# Altium project STM32F417 Demo Board.PrjPcb (part 4 of 4)

## Sheet Mechanical.SchDoc
size A3; SheetNumber: 14; SheetTotal: 15
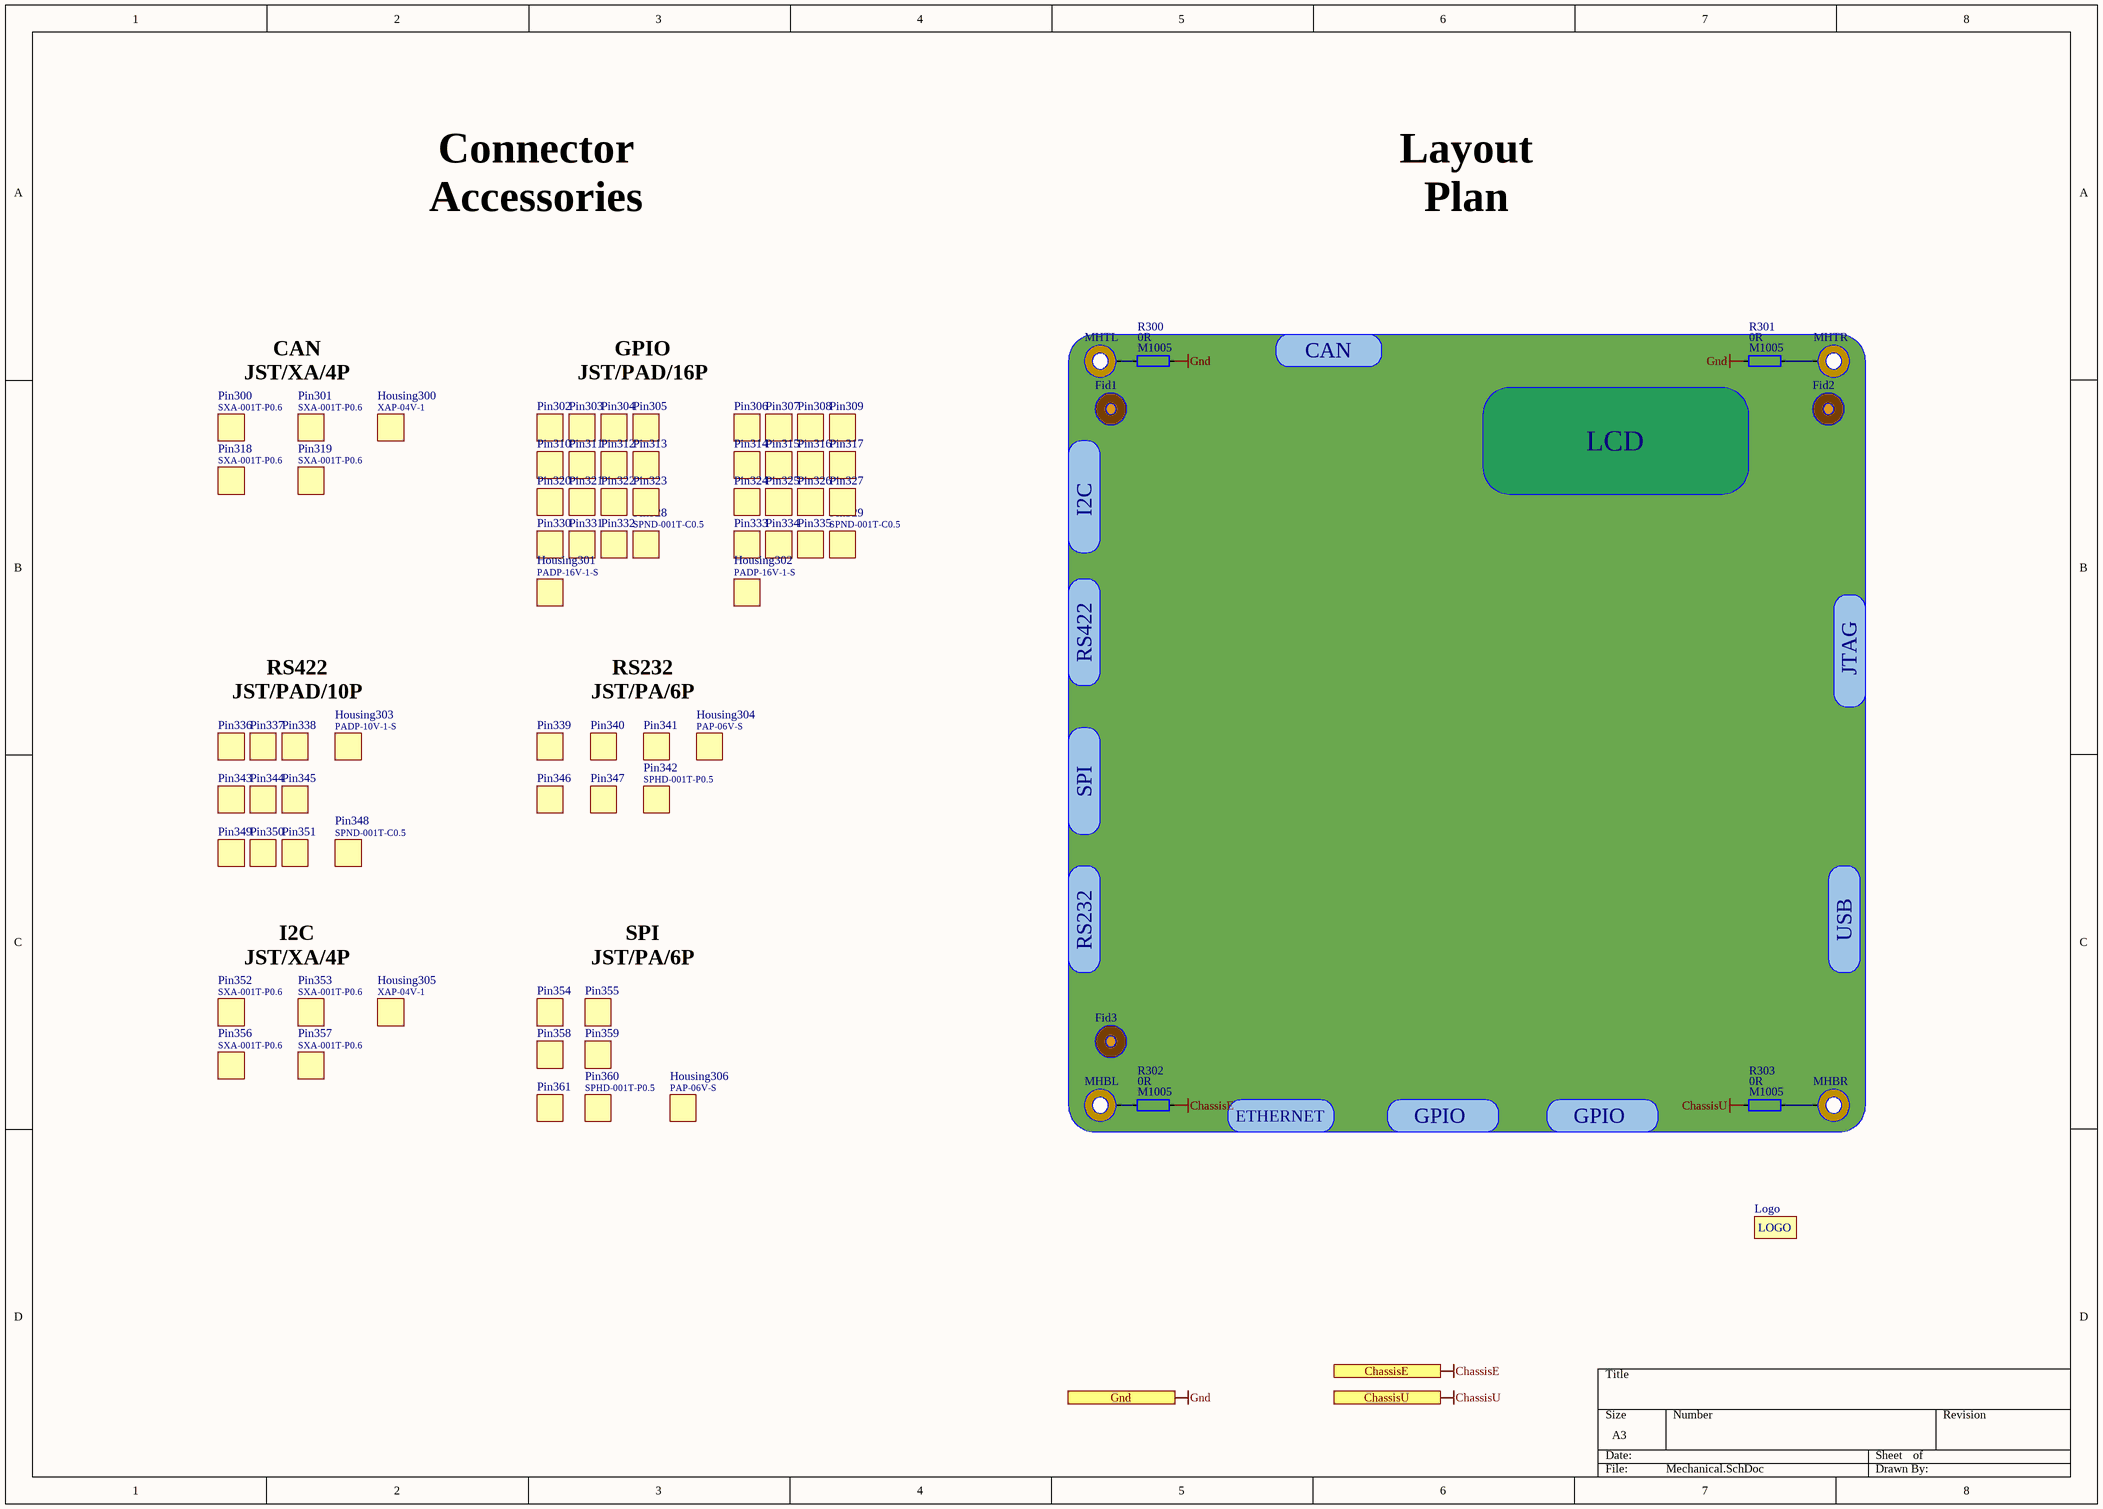
[diagram p13: Mechanical.SchDoc]

### Parts
Fid1  Fiducial  [Fiducial - 2mm, 5mm]  (value not drawn)  (no BOM)
Fid2  Fiducial  [Fiducial - 2mm, 5mm]  (value not drawn)  (no BOM)
Fid3  Fiducial  [Fiducial - 2mm, 5mm]  (value not drawn)  (no BOM)
Housing300  Manufacturer Part Number: XAP-04V-1  [Housing, PAP-06V-S]  (hidden comment: Housing)
Housing301  Manufacturer Part Number: PADP-16V-1-S  [Housing, PADP-16V-1-S]  (hidden comment: Housing)
Housing302  Manufacturer Part Number: PADP-16V-1-S  [Housing, PADP-16V-1-S]  (hidden comment: Housing)
Housing303  Manufacturer Part Number: PADP-10V-1-S  [Housing, PADP-10V-1-S]  (hidden comment: Housing)
Housing304  Manufacturer Part Number: PAP-06V-S  [Housing, PAP-06V-S]  (hidden comment: Housing)
Housing305  Manufacturer Part Number: XAP-04V-1  [Housing, PAP-06V-S]  (hidden comment: Housing)
Housing306  Manufacturer Part Number: PAP-06V-S  [Housing, PAP-06V-S]  (hidden comment: Housing)
Logo  Logo  [Logo 1]  (value not drawn)  (no BOM)
MHBL  Mounting Hole  [Mounting Hole - Hole-3.2mm, Pad-5mm]  (value not drawn)  (no BOM)
MHBR  Mounting Hole  [Mounting Hole - Hole-3.2mm, Pad-5mm]  (value not drawn)  (no BOM)
MHTL  Mounting Hole  [Mounting Hole - Hole-3.2mm, Pad-5mm]  (value not drawn)  (no BOM)
MHTR  Mounting Hole  [Mounting Hole - Hole-3.2mm, Pad-5mm]  (value not drawn)  (no BOM)
Pin300  Manufacturer Part Number: SXA-001T-P0.6  [Pin, SPHD-001T-P0.5]  (hidden comment: Pin)
Pin301  Manufacturer Part Number: SXA-001T-P0.6  [Pin, SPHD-001T-P0.5]  (hidden comment: Pin)
Pin302  Pin  [Pin, SPND-001T-C0.5]  (value not drawn)
Pin303  Pin  [Pin, SPND-001T-C0.5]  (value not drawn)
Pin304  Pin  [Pin, SPND-001T-C0.5]  (value not drawn)
Pin305  Pin  [Pin, SPND-001T-C0.5]  (value not drawn)
Pin306  Pin  [Pin, SPND-001T-C0.5]  (value not drawn)
Pin307  Pin  [Pin, SPND-001T-C0.5]  (value not drawn)
Pin308  Pin  [Pin, SPND-001T-C0.5]  (value not drawn)
Pin309  Pin  [Pin, SPND-001T-C0.5]  (value not drawn)
Pin310  Pin  [Pin, SPND-001T-C0.5]  (value not drawn)
Pin311  Pin  [Pin, SPND-001T-C0.5]  (value not drawn)
Pin312  Pin  [Pin, SPND-001T-C0.5]  (value not drawn)
Pin313  Pin  [Pin, SPND-001T-C0.5]  (value not drawn)
Pin314  Pin  [Pin, SPND-001T-C0.5]  (value not drawn)
Pin315  Pin  [Pin, SPND-001T-C0.5]  (value not drawn)
Pin316  Pin  [Pin, SPND-001T-C0.5]  (value not drawn)
Pin317  Pin  [Pin, SPND-001T-C0.5]  (value not drawn)
Pin318  Manufacturer Part Number: SXA-001T-P0.6  [Pin, SPHD-001T-P0.5]  (hidden comment: Pin)
Pin319  Manufacturer Part Number: SXA-001T-P0.6  [Pin, SPHD-001T-P0.5]  (hidden comment: Pin)
Pin320  Pin  [Pin, SPND-001T-C0.5]  (value not drawn)
Pin321  Pin  [Pin, SPND-001T-C0.5]  (value not drawn)
Pin322  Pin  [Pin, SPND-001T-C0.5]  (value not drawn)
Pin323  Pin  [Pin, SPND-001T-C0.5]  (value not drawn)
Pin324  Pin  [Pin, SPND-001T-C0.5]  (value not drawn)
Pin325  Pin  [Pin, SPND-001T-C0.5]  (value not drawn)
Pin326  Pin  [Pin, SPND-001T-C0.5]  (value not drawn)
Pin327  Pin  [Pin, SPND-001T-C0.5]  (value not drawn)
Pin328  Manufacturer Part Number: SPND-001T-C0.5  [Pin, SPND-001T-C0.5]  (hidden comment: Pin)
Pin329  Manufacturer Part Number: SPND-001T-C0.5  [Pin, SPND-001T-C0.5]  (hidden comment: Pin)
Pin330  Pin  [Pin, SPND-001T-C0.5]  (value not drawn)
Pin331  Pin  [Pin, SPND-001T-C0.5]  (value not drawn)
Pin332  Pin  [Pin, SPND-001T-C0.5]  (value not drawn)
Pin333  Pin  [Pin, SPND-001T-C0.5]  (value not drawn)
Pin334  Pin  [Pin, SPND-001T-C0.5]  (value not drawn)
Pin335  Pin  [Pin, SPND-001T-C0.5]  (value not drawn)
Pin336  Pin  [Pin, SPND-001T-C0.5]  (value not drawn)
Pin337  Pin  [Pin, SPND-001T-C0.5]  (value not drawn)
Pin338  Pin  [Pin, SPND-001T-C0.5]  (value not drawn)
Pin339  Pin  [Pin, SPHD-001T-P0.5]  (value not drawn)
Pin340  Pin  [Pin, SPHD-001T-P0.5]  (value not drawn)
Pin341  Pin  [Pin, SPHD-001T-P0.5]  (value not drawn)
Pin342  Manufacturer Part Number: SPHD-001T-P0.5  [Pin, SPHD-001T-P0.5]  (hidden comment: Pin)
Pin343  Pin  [Pin, SPND-001T-C0.5]  (value not drawn)
Pin344  Pin  [Pin, SPND-001T-C0.5]  (value not drawn)
Pin345  Pin  [Pin, SPND-001T-C0.5]  (value not drawn)
Pin346  Pin  [Pin, SPHD-001T-P0.5]  (value not drawn)
Pin347  Pin  [Pin, SPHD-001T-P0.5]  (value not drawn)
Pin348  Manufacturer Part Number: SPND-001T-C0.5  [Pin, SPND-001T-C0.5]  (hidden comment: Pin)
Pin349  Pin  [Pin, SPND-001T-C0.5]  (value not drawn)
Pin350  Pin  [Pin, SPND-001T-C0.5]  (value not drawn)
Pin351  Pin  [Pin, SPND-001T-C0.5]  (value not drawn)
Pin352  Manufacturer Part Number: SXA-001T-P0.6  [Pin, SPHD-001T-P0.5]  (hidden comment: Pin)
Pin353  Manufacturer Part Number: SXA-001T-P0.6  [Pin, SPHD-001T-P0.5]  (hidden comment: Pin)
Pin354  Pin  [Pin, SPHD-001T-P0.5]  (value not drawn)
Pin355  Pin  [Pin, SPHD-001T-P0.5]  (value not drawn)
Pin356  Manufacturer Part Number: SXA-001T-P0.6  [Pin, SPHD-001T-P0.5]  (hidden comment: Pin)
Pin357  Manufacturer Part Number: SXA-001T-P0.6  [Pin, SPHD-001T-P0.5]  (hidden comment: Pin)
Pin358  Pin  [Pin, SPHD-001T-P0.5]  (value not drawn)
Pin359  Pin  [Pin, SPHD-001T-P0.5]  (value not drawn)
Pin360  Manufacturer Part Number: SPHD-001T-P0.5  [Pin, SPHD-001T-P0.5]  (hidden comment: Pin)
Pin361  Pin  [Pin, SPHD-001T-P0.5]  (value not drawn)
R300  value 0R  Package: M1005  [Resistor_Smd_M1005_I0402]  (hidden comment: Resistor)
R301  value 0R  Package: M1005  [Resistor_Smd_M1005_I0402]  (hidden comment: Resistor)
R302  value 0R  Package: M1005  [Resistor_Smd_M1005_I0402]  (hidden comment: Resistor)
R303  value 0R  Package: M1005  [Resistor_Smd_M1005_I0402]  (hidden comment: Resistor)

### Blocks framed on the sheet
LCD: Fid1-Fid3 MHBL MHBR MHTL MHTR R300-R303

### Ports
ChassisE (out), ChassisU (out), Gnd (in)

### Nets
ChassisE: R302.2 ; port ChassisE
ChassisU: R303.1 ; port ChassisU
Gnd: R300.2 R301.1 ; port Gnd
NetMHBL_Hole: MHBL.Hole R302.1
NetMHBR_Hole: MHBR.Hole R303.2
NetMHTL_Hole: MHTL.Hole R300.1
NetMHTR_Hole: MHTR.Hole R301.2

### Notes on the sheet
- Connector
  Accessories
- Layout
  Plan
- CAN
  JST/XA/4P
- GPIO
  JST/PAD/16P
- CAN
- I2C
- RS422
- JTAG
- RS422
  JST/PAD/10P
- RS232
  JST/PA/6P
- SPI
- RS232
- USB
- I2C
  JST/XA/4P
- SPI
  JST/PA/6P
- ETHERNET
- GPIO
- (in symbol Logo) LOGO

### Library data of the parts
Fid1-Fid3 = Fiducial: Mechanical, Fiducial, PCB, 2mm/5mm; Component Type: Fiducial; Component Category: Mechanical
Housing300 Housing305 = Housing: Housing, JST, 4P, XA; Component Category: Connector; ComponentLink1Description: Datasheet; ComponentLink1URL: E:\Altium\Datasheets\Connector - JST\XA Family.pdf; ComponentLink2Description: Supplier Link; ComponentLink2URL: https://www.digikey.com/en/products/detail/jst-sales-america-inc/XAP-04V-1/959010; Supplier: Digikey; Supplier Part Number: 455-2150-ND; Manufacturer: JST; Operating Temperature, Min: -25℃; Operating Temperature, Max: +85℃; Quantity, Min: 1; Quantity, Max: 2500; Price, Min: 0.16; Supplier Currency: $; Price, Max: 0.05958; Supplier Link: https://www.digikey.com/en/products/detail/jst-sales-america-inc/XAP-04V-1/959010; Component Type: Housing; Package: Housing
Housing301 Housing302 = Housing: Housing, JST, 16P, PAD; Component Category: Connector; ComponentLink1Description: Datasheet; ComponentLink1URL: E:\Altium\Datasheets\Connector - JST\PAD Family.pdf; ComponentLink2Description: Supplier Link; ComponentLink2URL: https://www.digikey.com/en/products/detail/jst-sales-america-inc/PADP-16V-1-S/1300224; Supplier: Digikey; Supplier Part Number: 455-2143-ND; Manufacturer: JST; Operating Temperature, Min: -25℃; Operating Temperature, Max: +85℃; Quantity, Min: 1; Quantity, Max: 2500; Price, Min: 0.35; Supplier Currency: $; Price, Max: 0.152; Supplier Link: https://www.digikey.com/en/products/detail/jst-sales-america-inc/PADP-16V-1-S/1300224?s=N4IgTCBcDaIAoEEAicC0BGAbANQyAugL5A; Component Type: PCB; Package: Housing
Housing303 = Housing: Housing, JST, 10P, PAD; Component Category: Connector; ComponentLink1Description: Datasheet; ComponentLink1URL: E:\Altium\Datasheets\Connector - JST\PAD Family.pdf; ComponentLink2Description: Supplier Link; ComponentLink2URL: https://www.digikey.com/en/products/detail/jst-sales-america-inc/PADP-10V-1-S/1300221; Supplier: Digikey; Supplier Part Number: 455-2140-ND; Manufacturer: JST; Operating Temperature, Min: -25℃; Operating Temperature, Max: +85℃; Quantity, Min: 1; Quantity, Max: 2500; Price, Min: 0.33; Supplier Currency: $; Price, Max: 0.14264; Supplier Link: https://www.digikey.com/en/products/detail/jst-sales-america-inc/PADP-10V-1-S/1300221; Component Type: PCB; Package: Housing
Housing304 = Housing: Housing, JST, PAP-06V-S; Component Category: Connector; ComponentLink1Description: Datasheet; ComponentLink1URL: E:\Altium\Datasheets\Connector - JST\PA Family.pdf; ComponentLink2Description: Supplier Link; ComponentLink2URL: https://www.digikey.com/en/products/detail/jst-sales-america-inc/PAP-06V-S/759978; Supplier: Digikey; Supplier Part Number: 455-1490-ND; Manufacturer: JST; Operating Temperature, Min: -25℃; Operating Temperature, Max: +85℃; Quantity, Min: 1; Quantity, Max: 2500; Price, Min: 0.19; Supplier Currency: $; Price, Max: 0.07808; Supplier Link: https://www.digikey.com/en/products/detail/jst-sales-america-inc/PAP-06V-S/759978; Component Type: PCB; Package: Housing
Housing306 = Housing: IC, Interface, FTDI, QFN-16; Manufacturer: JST; Component Category: Connector; ComponentLink1Description: Datasheet; ComponentLink1URL: E:\Altium\Datasheets\Connector - JST\PA Family.pdf; ComponentLink2Description: Supplier Link; ComponentLink2URL: https://www.digikey.com/en/products/detail/jst-sales-america-inc/PAP-06V-S/759978; Supplier: Digikey; Supplier Part Number: 455-1490-ND; Operating Temperature, Min: -25℃; Operating Temperature, Max: +85℃; Quantity, Min: 1; Quantity, Max: 2500; Price, Min: 0.19; Supplier Currency: $; Price, Max: 0.07808; Supplier Link: https://www.digikey.com/en/products/detail/jst-sales-america-inc/PAP-06V-S/759978; Component Type: PCB; Package: Housing
Logo = Logo: Mechanical, Logo; Component Type: Logo; Component Category: Mechanical
MHBL MHBR MHTL MHTR = Mounting Hole: Mechanical, Mounting Hole; Component Type: Mounting Hole; Component Category: Mechanical
Pin300 Pin301 Pin318 Pin319 Pin352 Pin353 Pin356 Pin357 = Pin: Pin, JST, SXA-001T-P0.6; Component Category: Connector; ComponentLink1Description: Datasheet; ComponentLink1URL: E:\Altium\Datasheets\Connector - JST\XA Family.pdf; ComponentLink2Description: Supplier Link; ComponentLink2URL: https://www.digikey.com/en/products/detail/jst-sales-america-inc/SXA-001T-P0-6/923775; Supplier: Digikey; Supplier Part Number: 455-1904-1-ND; Manufacturer: JST; Operating Temperature, Min: ---℃; Operating Temperature, Max: ---℃; Quantity, Min: 1; Quantity, Max: 56000; Price, Min: 0.1; Supplier Currency: $; Price, Max: 0.01303; Supplier Link: https://www.digikey.com/en/products/detail/jst-sales-america-inc/SXA-001T-P0-6/923775; Component Type: Pin; Package: Housing
Pin302-Pin317 Pin320-Pin338 Pin343-Pin345 Pin348-Pin351 = Pin: Pin, JST, SPND-001T-C0.5; Component Category: Connector; ComponentLink1Description: Datasheet; ComponentLink1URL: E:\Altium\Datasheets\Connector - JST\PAD Family.pdf; ComponentLink2Description: Supplier Link; ComponentLink2URL: https://www.digikey.com/en/products/detail/jst-sales-america-inc/SPND-001T-C0-5/1788519; Supplier: Digikey; Supplier Part Number: 455-2303-1-ND; Manufacturer: JST; Operating Temperature, Min: ---℃; Operating Temperature, Max: ---℃; Quantity, Min: 1; Quantity, Max: 56000; Price, Min: 0.1; Supplier Currency: $; Price, Max: 0.01409; Supplier Link: https://www.digikey.com/en/products/detail/jst-sales-america-inc/SPND-001T-C0-5/1788519; Component Type: PCB; Package: Housing
  Pin302-Pin317 Pin320-Pin327 Pin330-Pin338 Pin343-Pin345 Pin349-Pin351: Manufacturer Part Number: SPND-001T-C0.5
Pin339-Pin342 Pin346 Pin347 = Pin: Pin, JST, SPHD-001T-P0.5; Component Category: Connector; ComponentLink1Description: Datasheet; ComponentLink1URL: E:\Altium\Datasheets\Connector - JST\PA Family.pdf; ComponentLink2Description: Supplier Link; ComponentLink2URL: https://www.digikey.com/en/products/detail/jst-sales-america-inc/SPHD-001T-P0-5/608766; Supplier: Digikey; Supplier Part Number: 455-1325-1-ND; Manufacturer: JST; Operating Temperature, Min: *℃; Operating Temperature, Max: *℃; Quantity, Min: 1; Quantity, Max: 2500; Price, Min: 0.1; Supplier Currency: $; Price, Max: 0.01478; Supplier Link: https://www.digikey.com/en/products/detail/jst-sales-america-inc/SPHD-001T-P0-5/608766; Component Type: PCB; Package: Housing
  Pin339-Pin341 Pin346 Pin347: Manufacturer Part Number: SPHD-001T-P0.5
Pin354 Pin355 Pin358 Pin359 Pin361 = Pin: IC, Interface, FTDI, QFN-16; Manufacturer: JST; Manufacturer Part Number: SPHD-001T-P0.5; Component Category: Connector; ComponentLink1Description: Datasheet; ComponentLink1URL: E:\Altium\Datasheets\Connector - JST\PA Family.pdf; ComponentLink2Description: Supplier Link; ComponentLink2URL: https://www.digikey.com/en/products/detail/jst-sales-america-inc/SPHD-001T-P0-5/608766; Supplier: Digikey; Supplier Part Number: 455-1325-1-ND; Operating Temperature, Min: *℃; Operating Temperature, Max: *℃; Quantity, Min: 1; Quantity, Max: 2500; Price, Min: 0.1; Supplier Currency: $; Price, Max: 0.01478; Supplier Link: https://www.digikey.com/en/products/detail/jst-sales-america-inc/SPHD-001T-P0-5/608766; Component Type: PCB; Package: Housing
Pin360 = Pin: IC, Interface, FTDI, QFN-16; Manufacturer: JST; Component Category: Connector; ComponentLink1Description: Datasheet; ComponentLink1URL: E:\Altium\Datasheets\Connector - JST\PA Family.pdf; ComponentLink2Description: Supplier Link; ComponentLink2URL: https://www.digikey.com/en/products/detail/jst-sales-america-inc/SPHD-001T-P0-5/608766; Supplier: Digikey; Supplier Part Number: 455-1325-1-ND; Operating Temperature, Min: *℃; Operating Temperature, Max: *℃; Quantity, Min: 1; Quantity, Max: 2500; Price, Min: 0.1; Supplier Currency: $; Price, Max: 0.01478; Supplier Link: https://www.digikey.com/en/products/detail/jst-sales-america-inc/SPHD-001T-P0-5/608766; Component Type: PCB; Package: Housing
R300-R303 = Resistor: Res, 0R, M1005; Manufacturer: Yageo; Manufacturer Part Number: RC0402FR-070RL; Component Category: Resistor; Component Type: Fixed Value; Tolerance: *; Supplier Link: https://www.digikey.com/en/products/detail/yageo/RC0402FR-070RL/2827570; Supplier Currency: $; Price, Max: 0.00109; Price, Min: 0.1; Quantity, Max: 50000; Quantity, Min: 1; Operating Temperature, Max: -55℃; Operating Temperature, Min: +155℃; Supplier Part Number: 311-0.0LRCT-ND; Supplier: Digikey; ComponentLink1Description: Datasheet; ComponentLink1URL: E:\Altium\Datasheets\Resistor\Yageo - RC_L Series.pdf; ComponentLink2Description: Supplier Link; ComponentLink2URL: https://www.digikey.com/en/products/detail/yageo/RC0402FR-070RL/2827570

## Sheet I2C-SPI.SchDoc
size A4; SheetNumber: 15; SheetTotal: 15
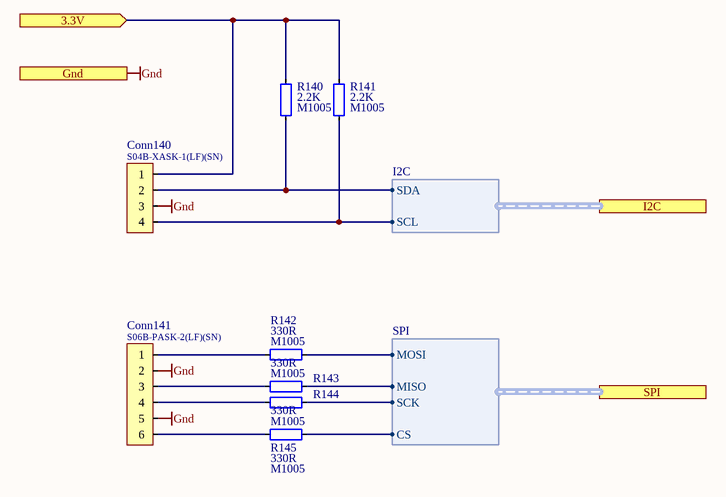
[diagram p14: I2C-SPI.SchDoc]

### Parts
Conn140  Manufacturer Part Number: S04B-XASK-1(LF)(SN)  [Connector, S04B-XASK-1]  (hidden comment: Connector - 4P)
Conn141  Manufacturer Part Number: S06B-PASK-2(LF)(SN)  [Connector, S06B-PASK-2]  (hidden comment: Connector - 6P)
R140  value 2.2K  Package: M1005  [Resistor_Smd_M1005_I0402]  (hidden comment: Resistor)
R141  value 2.2K  Package: M1005  [Resistor_Smd_M1005_I0402]  (hidden comment: Resistor)
R142  value 330R  Package: M1005  [Resistor_Smd_M1005_I0402]  (hidden comment: Resistor)
R143  value 330R  Package: M1005  [Resistor_Smd_M1005_I0402]  (hidden comment: Resistor)
R144  value 330R  Package: M1005  [Resistor_Smd_M1005_I0402]  (hidden comment: Resistor)
R145  value 330R  Package: M1005  [Resistor_Smd_M1005_I0402]  (hidden comment: Resistor)

### Ports
3.3V (in), Gnd (in), I2C (harness I2C), SPI (harness SPI)

### Harnesses
SPI: MOSI, MISO, SCK, CS
I2C: SDA, SCL

### Nets
3.3V: Conn140.1 R140.1 R141.1 ; port 3.3V
Gnd: Conn140.3 Conn141.2 Conn141.5 ; port Gnd
I2C1_Scl: Conn140.4 R141.2 ; port I2C.SCL
I2C1_Sda: Conn140.2 R140.2 ; port I2C.SDA
MISO: R143.2 ; port SPI.MISO
MOSI: R142.2 ; port SPI.MOSI
PA4: R145.2 ; port SPI.CS
PA5: R144.2 ; port SPI.SCK
NetConn141_1: Conn141.1 R142.1
NetConn141_3: Conn141.3 R143.1
NetConn141_4: Conn141.4 R144.1
NetConn141_6: Conn141.6 R145.1

### Library data of the parts
Conn140 = Connector - 4P: Conn, JST, 4P, TH, XA, Side Entry; ComponentLink1Description: Datasheet; ComponentLink1URL: E:\Altium\Datasheets\Connector - JST\XA Family.pdf; ComponentLink2Description: Supplier Link; ComponentLink2URL: https://www.digikey.com/en/products/detail/jst-sales-america-inc/S04B-XASK-1-LF-SN/7230506; Supplier: Digikey; Supplier Part Number: 455-4090-ND; Manufacturer: JST; Operating Temperature, Min: -25℃; Operating Temperature, Max: +85℃; Quantity, Min: 1; Quantity, Max: 10000; Price, Min: 0.53; Supplier Currency: $; Price, Max: 0.22547; Supplier Link: https://www.digikey.com/en/products/detail/jst-sales-america-inc/S04B-XASK-1-LF-SN/7230506; Component Type: PCB; Component Category: Connector; Package: SMD, TH, Side Entry
Conn141 = Connector - 6P: Conn, JST, 6P, TH, PA, Side Entry; ComponentLink1Description: Datasheet; ComponentLink1URL: E:\Altium\Datasheets\Connector - JST\PA Family.pdf; ComponentLink2Description: Supplier Link; ComponentLink2URL: https://www.digikey.com/en/products/detail/jst-sales-america-inc/S06B-PASK-2-LF-SN/926757; Supplier: Digikey; Supplier Part Number: 455-1851-ND; Manufacturer: JST; Operating Temperature, Min: -25℃; Operating Temperature, Max: +85℃; Quantity, Min: 1; Quantity, Max: 10000; Price, Min: 0.51; Supplier Currency: $; Price, Max: 0.21423; Supplier Link: https://www.digikey.com/en/products/detail/jst-sales-america-inc/S06B-PASK-2-LF-SN/926757; Component Type: PCB; Component Category: Connector; Package: TH, RA, Side Entry
R140 R141 = Resistor: Res, 2.2K, 1%, M1005; Manufacturer: Yageo; Manufacturer Part Number: RC0402FR-072K2L; Component Category: Resistor; Component Type: Fixed Value; Tolerance: 1%; Supplier Link: https://www.digikey.com/en/products/detail/yageo/RC0402FR-072K2L/726553; Supplier Currency: $; Price, Max: 0.00129; Price, Min: 0.1; Quantity, Max: 100000; Quantity, Min: 1; Operating Temperature, Max: -55℃; Operating Temperature, Min: +155℃; Supplier Part Number: 311-2.20KLRCT-ND; Supplier: Digikey; ComponentLink1Description: Datasheet; ComponentLink1URL: E:\Altium\Datasheets\Resistor\Yageo - RC_L Series.pdf; ComponentLink2Description: Supplier Link; ComponentLink2URL: https://www.digikey.com/en/products/detail/yageo/RC0402FR-072K2L/726553
R142-R145 = Resistor: Res, 330R, 1%, M1005; Manufacturer: Yageo; Manufacturer Part Number: RC0402FR-07330RL; Component Category: Resistor; Component Type: Fixed Value; Tolerance: 1%; Supplier Link: https://www.digikey.com/en/products/detail/yageo/RC0402FR-07330RL/726594; Supplier Currency: $; Price, Max: 0.00129; Price, Min: 0.1; Quantity, Max: 100000; Quantity, Min: 1; Operating Temperature, Max: -55℃; Operating Temperature, Min: +155℃; Supplier Part Number: 311-330LRCT-ND; Supplier: Digikey; ComponentLink1Description: Datasheet; ComponentLink1URL: E:\Altium\Datasheets\Resistor\Yageo - RC_L Series.pdf; ComponentLink2Description: Supplier Link; ComponentLink2URL: https://www.digikey.com/en/products/detail/yageo/RC0402FR-07330RL/726594

## Nets that join several sheets
3.3V: Microcontroller (Conn700.1 Conn700.2 R706.1 R716.1), LCD (R670.1), FTDI (R682.1), Power (R114.2 R115.2), GPIO (R201.1 R202.2 R204.1 R205.2), GPIO/Bt1 (Sw40_Bt1.A), GPIO/Bt2 (Sw40_Bt2.A), GPIO/Bt3 (Sw40_Bt3.A), GPIO/Sw1 (Sw60_Sw1.A), GPIO/Sw2 (Sw60_Sw2.A), GPIO/Sw3 (Sw60_Sw3.A), GPIO/LdR (R80_LdR.1), GPIO/LdO (R80_LdO.1), GPIO/LdY (R80_LdY.1), GPIO/LdG (R80_LdG.1), Ethernet (R747.1), RS422 (R641.1), RS232 (R620.1), CAN (R600.1), I2C-SPI (Conn140.1 R140.1 R141.1)
5V: LCD (R669.1), FTDI (R675.1 R683.2), Power (R100.1 R108.1), GPIO (R200.2 R203.2), CAN (R603.1)
ChassisE: Ethernet (C749.2 C751.2 Conn740.Shield), Mechanical (R302.2)
ChassisU: FTDI (5 pins), Mechanical (R303.1)
Gnd: Microcontroller (38 pins), LCD (6 pins), FTDI (16 pins), Power (21 pins), GPIO (26 pins), GPIO/Bt1 (C40_Bt1.2 R41_Bt1.2), GPIO/Bt2 (C40_Bt2.2 R41_Bt2.2), GPIO/Bt3 (C40_Bt3.2 R41_Bt3.2), GPIO/Sw1 (C60_Sw1.2 R61_Sw1.2), GPIO/Sw2 (C60_Sw2.2 R61_Sw2.2), GPIO/Sw3 (C60_Sw3.2 R61_Sw3.2), GPIO/LdR (Q80_LdR.S R81_LdR.2), GPIO/LdO (Q80_LdO.S R81_LdO.2), GPIO/LdY (Q80_LdY.S R81_LdY.2), GPIO/LdG (Q80_LdG.S R81_LdG.2), Ethernet (21 pins), RS422 (10 pins), RS232 (8 pins), CAN (C600.2 IC600.4 R604.1), Mechanical (R300.2 R301.1), I2C-SPI (Conn140.3 Conn141.2 Conn141.5)
CanRx: Microcontroller (IC700.81), CAN (IC600.2)
CanTx: Microcontroller (IC700.82), CAN (IC600.3)
CRS_DV: Microcontroller (IC700.32), Ethernet (IC740.40 R740.2)
I2C1_Scl: Microcontroller (IC700.92), I2C-SPI (Conn140.4 R141.2)
I2C1_Sda: Microcontroller (IC700.93), I2C-SPI (Conn140.2 R140.2)
I2C3_Scl: Microcontroller (IC700.67), LCD (IC661.4 R666.2)
I2C3_Sda: Microcontroller (IC700.66), LCD (IC661.3 R665.2)
MDC: Microcontroller (IC700.16), Ethernet (IC740.31)
MDIO: Microcontroller (IC700.25), Ethernet (IC740.30 R757.2)
MISO: Microcontroller (IC700.31), I2C-SPI (R143.2)
MOSI: Microcontroller (IC700.91), I2C-SPI (R142.2)
NetD200_A: GPIO (D200.A), GPIO/LdR (R80_LdR.2)
NetD200_C: GPIO (D200.C), GPIO/LdR (Q80_LdR.D)
NetD201_A: GPIO (D201.A), GPIO/LdO (R80_LdO.2)
NetD201_C: GPIO (D201.C), GPIO/LdO (Q80_LdO.D)
NetD202_A: GPIO (D202.A), GPIO/LdY (R80_LdY.2)
NetD202_C: GPIO (D202.C), GPIO/LdY (Q80_LdY.D)
NetD203_A: GPIO (D203.A), GPIO/LdG (R80_LdG.2)
NetD203_C: GPIO (D203.C), GPIO/LdG (Q80_LdG.D)
NRST: Microcontroller (C700.1 IC700.14 R705.1 R707.2), Ethernet (R745.1)
OSCIN: Microcontroller (IC700.24), Ethernet (IC740.34 IC741.OUT)
PA0: Microcontroller (IC700.23), RS232 (R622.1)
PA3: Microcontroller (IC700.26), RS232 (R621.1)
PA4: Microcontroller (IC700.29), I2C-SPI (R145.2)
PA5: Microcontroller (IC700.30), I2C-SPI (R144.2)
PA9: Microcontroller (IC700.68), RS422 (IC640.3)
PA10: Microcontroller (IC700.69), RS422 (R644.1 R645.1)
PA11: Microcontroller (IC700.70), RS422 (R652.1 R653.1)
PA12: Microcontroller (IC700.71), RS422 (IC641.3)
PB1: Microcontroller (IC700.36), GPIO (IC201.2)
PB8: Microcontroller (IC700.95), GPIO/Sw2 (C60_Sw2.1 R60_Sw2.2)
PB9: Microcontroller (IC700.96), GPIO/Sw3 (C60_Sw3.1 R60_Sw3.2)
PB10: Microcontroller (IC700.47), FTDI (IC662.2 R672.2)
PB11: Microcontroller (IC700.48), Ethernet (IC740.2)
PB12: Microcontroller (IC700.51), Ethernet (IC740.3)
PB13: Microcontroller (IC700.52), Ethernet (IC740.4)
PB14: Microcontroller (IC700.53), FTDI (IC662.4 R674.2)
PB15: Microcontroller (IC700.54), GPIO (IC200.22)
PC4: Microcontroller (IC700.33), Ethernet (IC740.43)
PC5: Microcontroller (IC700.34), Ethernet (IC740.44)
PC6: Microcontroller (IC700.63), GPIO (IC200.16)
PC7: Microcontroller (IC700.64), GPIO (IC200.15)
PC8: Microcontroller (IC700.65), GPIO (IC200.14)
PD4: Microcontroller (IC700.85), RS232 (IC620.10)
PD5: Microcontroller (IC700.86), RS232 (IC620.11)
PD7: Microcontroller (IC700.88), GPIO/Sw1 (C60_Sw1.1 R60_Sw1.2)
PD8: Microcontroller (IC700.55), GPIO (IC200.2)
PD9: Microcontroller (IC700.56), FTDI (IC662.15 R671.2)
PD10: Microcontroller (IC700.57), GPIO (IC200.21)
PD11: Microcontroller (IC700.58), FTDI (IC662.16 R673.2)
PD12: Microcontroller (IC700.59), GPIO (IC200.20)
PD13: Microcontroller (IC700.60), GPIO (IC200.19)
PD14: Microcontroller (IC700.61), GPIO (IC200.18)
PD15: Microcontroller (IC700.62), GPIO (IC200.17)
PE0: Microcontroller (IC700.97), GPIO/Bt1 (C40_Bt1.1 R40_Bt1.2)
PE1: Microcontroller (IC700.98), GPIO/Bt2 (C40_Bt2.1 R40_Bt2.2)
PE2: Microcontroller (IC700.1), GPIO/Bt3 (C40_Bt3.1 R40_Bt3.2)
PE3: Microcontroller (IC700.2), GPIO/LdR (Q80_LdR.G R81_LdR.1)
PE4: Microcontroller (IC700.3), GPIO/LdO (Q80_LdO.G R81_LdO.1)
PE5: Microcontroller (IC700.4), GPIO/LdY (Q80_LdY.G R81_LdY.1)
PE6: Microcontroller (IC700.5), GPIO/LdG (Q80_LdG.G R81_LdG.1)
PE7: Microcontroller (IC700.38), GPIO (IC201.22)
PE8: Microcontroller (IC700.39), GPIO (IC201.21)
PE9: Microcontroller (IC700.40), GPIO (IC201.20)
PE10: Microcontroller (IC700.41), GPIO (IC201.19)
PE11: Microcontroller (IC700.42), GPIO (IC201.18)
PE12: Microcontroller (IC700.43), GPIO (IC201.17)
PE13: Microcontroller (IC700.44), GPIO (IC201.16)
PE14: Microcontroller (IC700.45), GPIO (IC201.15)
PE15: Microcontroller (IC700.46), GPIO (IC201.14)

## Assembly variants
Prototip_Assembly: not fitted C103 Housing300 Housing301 Housing302 Housing303 Housing304 Housing305 Housing306 Pin300 Pin301 Pin302 Pin303 Pin304 Pin305 Pin306 Pin307 Pin308 Pin309 Pin310 Pin311 Pin312 Pin313 Pin314 Pin315 Pin316 Pin317 Pin318 Pin319 Pin320 Pin321 Pin322 Pin323 Pin324 Pin325 Pin326 Pin327 Pin328 Pin329 Pin330 Pin331 Pin332 Pin333 Pin334 Pin335 Pin336 Pin337 Pin338 Pin339 Pin340 Pin341 Pin342 Pin343 Pin344 Pin345 Pin346 Pin347 Pin348 Pin349 Pin350 Pin351 Pin352 Pin353 Pin354 Pin355 Pin356 Pin357 Pin358 Pin359 Pin360 Pin361 R100 R108 R114 R115 R200 R203 R600 R601 R602 R603 R604 R620 R641 R657 R658 R669 R670 R682 R683 R710 R711 R716 R745 R747
Prototip: not fitted C103 R100 R108 R114 R115 R200 R203 R600 R601 R602 R603 R604 R620 R641 R657 R658 R669 R670 R682 R683 R710 R711 R716 R745 R747
Arge: not fitted C103 R114 R200 R203 R601 R602 R657 R658 R710 R711 R745
Seri: not fitted C103 D101 D102 D103 D660 D661 D662 D740 R102 R110 R113 R114 R200 R203 R300 R301 R302 R303 R601 R602 R657 R658 R677 R679 R681 R710 R711 R745 R748 Sw700